# EAGLE design estacao_2_motordc_v6 (EAGLE 8.0.0)
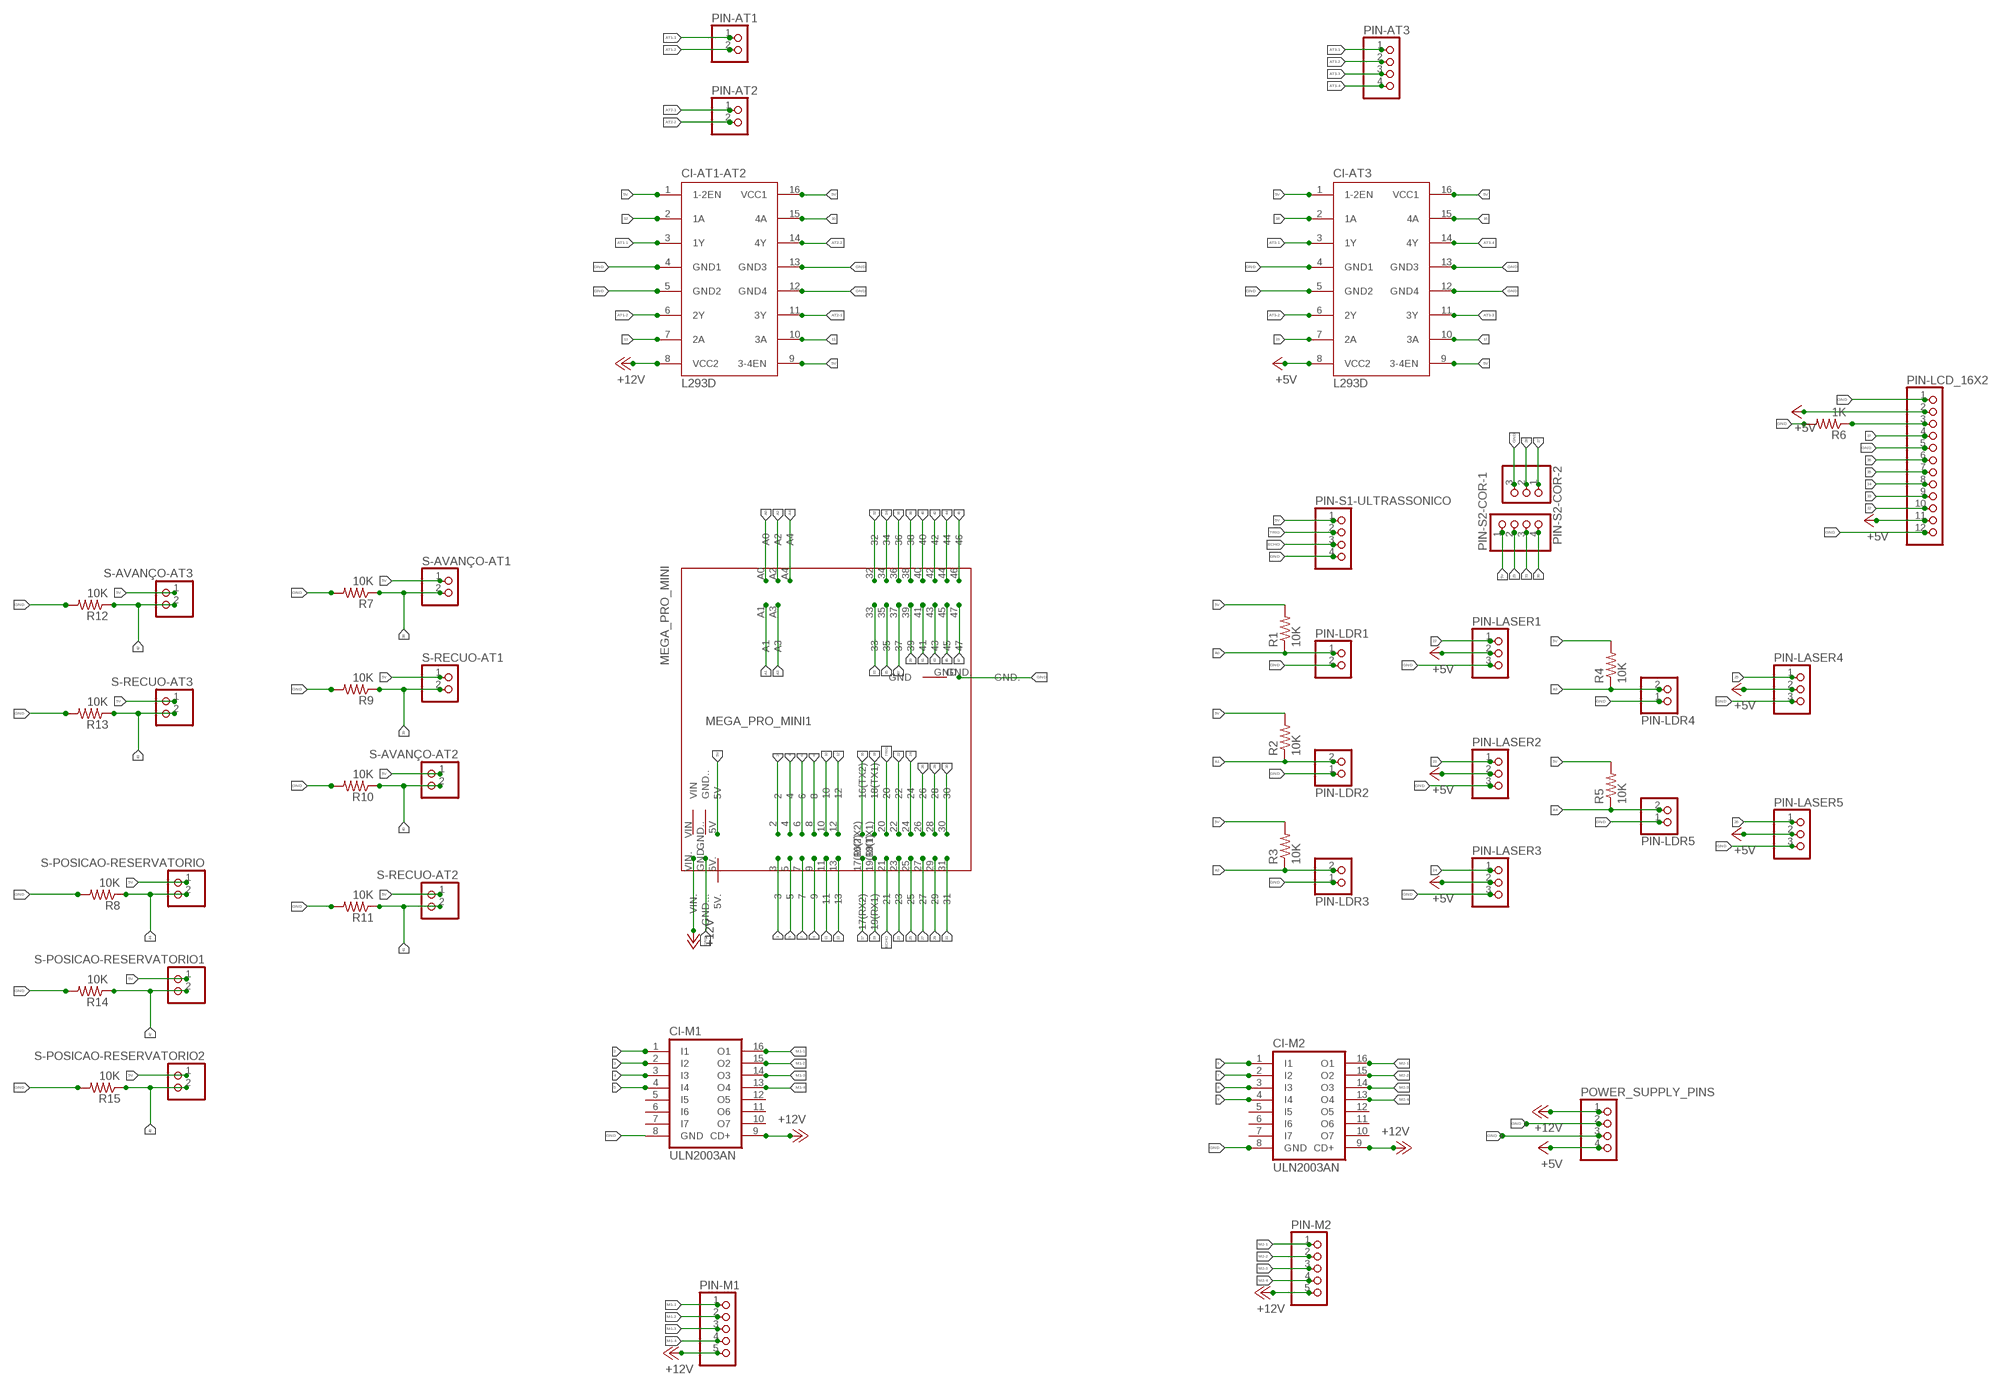
[diagram p0: schematic, sheet 1]

## Parts
CI-AT1-AT2  L293D  [DIL16]
CI-AT3  L293D  [DIL16]
CI-M1  ULN2003AN  [DIL16]
CI-M2  ULN2003AN  [DIL16]
MEGA_PRO_MINI1  MEGA_PRO_MINI  [MEGA_PRO_MINI]
PIN-AT1  PINHD-1X2  [1X02]
PIN-AT2  PINHD-1X2  [1X02]
PIN-AT3  PINHD-1X4  [1X04]
PIN-LASER1  PINHD-1X3  [1X03]
PIN-LASER2  PINHD-1X3  [1X03]
PIN-LASER3  PINHD-1X3  [1X03]
PIN-LASER4  PINHD-1X3  [1X03]
PIN-LASER5  PINHD-1X3  [1X03]
PIN-LCD_16X2  PINHD-1X12  [1X12]
PIN-LDR1  PINHD-1X2  [1X02]
PIN-LDR2  PINHD-1X2  [1X02]
PIN-LDR3  PINHD-1X2  [1X02]
PIN-LDR4  PINHD-1X2  [1X02]
PIN-LDR5  PINHD-1X2  [1X02]
PIN-M1  PINHD-1X5  [1X05]
PIN-M2  PINHD-1X5  [1X05]
PIN-S1-ULTRASSONICO  PINHD-1X4  [1X04]
PIN-S2-COR-1  PINHD-1X4  [1X04]
PIN-S2-COR-2  PINHD-1X3  [1X03]
POWER_SUPPLY_PINS  PINHD-1X4  [1X04]
R1  10K  R-US_0204/7  [0204/7]
R2  10K  R-US_0204/7  [0204/7]
R3  10K  R-US_0204/7  [0204/7]
R4  10K  R-US_0204/7  [0204/7]
R5  10K  R-US_0204/7  [0204/7]
R6  1K  R-US_0204/7  [0204/7]
R7  10K  R-US_0204/7  [0204/7]
R8  10K  R-US_0204/7  [0204/7]
R9  10K  R-US_0204/7  [0204/7]
R10  10K  R-US_0204/7  [0204/7]
R11  10K  R-US_0204/7  [0204/7]
R12  10K  R-US_0204/7  [0204/7]
R13  10K  R-US_0204/7  [0204/7]
R14  10K  R-US_0204/7  [0204/7]
R15  10K  R-US_0204/7  [0204/7]
S-AVANÇO-AT1  PINHD-1X2  [1X02]
S-AVANÇO-AT2  PINHD-1X2  [1X02]
S-AVANÇO-AT3  PINHD-1X2  [1X02]
S-POSICAO-RESERVATORIO  PINHD-1X2  [1X02]
S-POSICAO-RESERVATORIO1  PINHD-1X2  [1X02]
S-POSICAO-RESERVATORIO2  PINHD-1X2  [1X02]
S-RECUO-AT1  PINHD-1X2  [1X02]
S-RECUO-AT2  PINHD-1X2  [1X02]
S-RECUO-AT3  PINHD-1X2  [1X02]

## Nets
2: CI-M1.1(I1) MEGA_PRO_MINI1.2
3: CI-M1.2(I2) MEGA_PRO_MINI1.3
4: CI-M1.3(I3) MEGA_PRO_MINI1.4
5: CI-M1.4(I4) MEGA_PRO_MINI1.5
5V: CI-AT1-AT2.1(1-2EN) CI-AT1-AT2.9(3-4EN) CI-AT1-AT2.16(VCC1) CI-AT3.1(1-2EN) CI-AT3.9(3-4EN) CI-AT3.16(VCC1) MEGA_PRO_MINI1.5V PIN-S1-ULTRASSONICO.1 PIN-S2-COR-1.1 R1.2 R2.2 R3.2 R4.2 R5.2 S-AVANÇO-AT1.1 S-AVANÇO-AT2.1 S-AVANÇO-AT3.1 S-POSICAO-RESERVATORIO1.1 S-POSICAO-RESERVATORIO2.1 S-POSICAO-RESERVATORIO.1 S-RECUO-AT1.1 S-RECUO-AT2.1 S-RECUO-AT3.1
6: CI-M2.1(I1) MEGA_PRO_MINI1.6
7: CI-M2.2(I2) MEGA_PRO_MINI1.7
8: CI-M2.3(I3) MEGA_PRO_MINI1.8
9: CI-M2.4(I4) MEGA_PRO_MINI1.9
10: CI-AT1-AT2.15(4A) MEGA_PRO_MINI1.10
11: CI-AT1-AT2.10(3A) MEGA_PRO_MINI1.11
12: CI-AT1-AT2.2(1A) MEGA_PRO_MINI1.12
13: CI-AT1-AT2.7(2A) MEGA_PRO_MINI1.13
16: CI-AT3.15(4A) MEGA_PRO_MINI1.16(TX2)
17: CI-AT3.10(3A) MEGA_PRO_MINI1.17(RX2)
18: CI-AT3.2(1A) MEGA_PRO_MINI1.18(TX1)
19: CI-AT3.7(2A) MEGA_PRO_MINI1.19(RX1)
22: MEGA_PRO_MINI1.22 PIN-LASER1.1
23: MEGA_PRO_MINI1.23 PIN-LASER2.1
24: MEGA_PRO_MINI1.24 PIN-LASER3.1
25: MEGA_PRO_MINI1.25 PIN-LASER4.1
26: MEGA_PRO_MINI1.26 PIN-LASER5.1
27: MEGA_PRO_MINI1.27 PIN-S2-COR-2.1
28: MEGA_PRO_MINI1.28 PIN-S2-COR-2.2
29: MEGA_PRO_MINI1.29 PIN-S2-COR-1.2
30: MEGA_PRO_MINI1.30 PIN-S2-COR-1.4
31: MEGA_PRO_MINI1.31 PIN-S2-COR-1.3
32: MEGA_PRO_MINI1.32 PIN-LCD_16X2.10
33: MEGA_PRO_MINI1.33 PIN-LCD_16X2.9
34: MEGA_PRO_MINI1.34 PIN-LCD_16X2.8
35: MEGA_PRO_MINI1.35 PIN-LCD_16X2.7
36: MEGA_PRO_MINI1.36 PIN-LCD_16X2.6
37: MEGA_PRO_MINI1.37 PIN-LCD_16X2.4
38: MEGA_PRO_MINI1.38 R7.1 S-AVANÇO-AT1.2
39: MEGA_PRO_MINI1.39 R9.1 S-RECUO-AT1.2
40: MEGA_PRO_MINI1.40 R10.1 S-AVANÇO-AT2.2
41: MEGA_PRO_MINI1.41 R11.1 S-RECUO-AT2.2
42: MEGA_PRO_MINI1.42 R12.1 S-AVANÇO-AT3.2
43: MEGA_PRO_MINI1.43 R13.1 S-RECUO-AT3.2
44: MEGA_PRO_MINI1.44 R8.1 S-POSICAO-RESERVATORIO.2
45: MEGA_PRO_MINI1.45
46: MEGA_PRO_MINI1.46 R15.1 S-POSICAO-RESERVATORIO2.2
47: MEGA_PRO_MINI1.47 R14.1 S-POSICAO-RESERVATORIO1.2
+5V: CI-AT3.8(VCC2) PIN-LASER1.2 PIN-LASER2.2 PIN-LASER3.2 PIN-LASER4.2 PIN-LASER5.2 PIN-LCD_16X2.2 PIN-LCD_16X2.11 POWER_SUPPLY_PINS.4
+12V: CI-AT1-AT2.8(VCC2) CI-M1.9(CD+) CI-M2.9(CD+) MEGA_PRO_MINI1.VIN. PIN-M1.5 PIN-M2.5 POWER_SUPPLY_PINS.1
A0: MEGA_PRO_MINI1.A0 PIN-LDR1.1 R1.1
A1: MEGA_PRO_MINI1.A1 PIN-LDR2.2 R2.1
A2: MEGA_PRO_MINI1.A2 PIN-LDR3.2 R3.1
A3: MEGA_PRO_MINI1.A3 PIN-LDR4.2 R4.1
A4: MEGA_PRO_MINI1.A4 PIN-LDR5.2 R5.1
AT1-1: CI-AT1-AT2.3(1Y) PIN-AT1.1
AT1-2: CI-AT1-AT2.6(2Y) PIN-AT1.2
AT2-1: CI-AT1-AT2.11(3Y) PIN-AT2.1
AT2-2: CI-AT1-AT2.14(4Y) PIN-AT2.2
AT3-1: CI-AT3.3(1Y) PIN-AT3.1
AT3-2: CI-AT3.6(2Y) PIN-AT3.2
AT3-3: CI-AT3.11(3Y) PIN-AT3.3
AT3-4: CI-AT3.14(4Y) PIN-AT3.4
ECHO: MEGA_PRO_MINI1.21 PIN-S1-ULTRASSONICO.3
GND: CI-AT1-AT2.4(GND1) CI-AT1-AT2.5(GND2) CI-AT1-AT2.12(GND4) CI-AT1-AT2.13(GND3) CI-AT3.4(GND1) CI-AT3.5(GND2) CI-AT3.12(GND4) CI-AT3.13(GND3) CI-M1.8(GND) CI-M2.8(GND) MEGA_PRO_MINI1.GND. MEGA_PRO_MINI1.GND... PIN-LASER1.3 PIN-LASER2.3 PIN-LASER3.3 PIN-LASER4.3 PIN-LASER5.3 PIN-LCD_16X2.1 PIN-LCD_16X2.5 PIN-LCD_16X2.12 PIN-LDR1.2 PIN-LDR2.1 PIN-LDR3.1 PIN-LDR4.1 PIN-LDR5.1 PIN-S1-ULTRASSONICO.4 PIN-S2-COR-2.3 POWER_SUPPLY_PINS.2 POWER_SUPPLY_PINS.3 R6.2 R7.2 R8.2 R9.2 R10.2 R11.2 R12.2 R13.2 R14.2 R15.2
M1-1: CI-M1.16(O1) PIN-M1.1
M1-2: CI-M1.15(O2) PIN-M1.2
M1-3: CI-M1.14(O3) PIN-M1.3
M1-4: CI-M1.13(O4) PIN-M1.4
M2-1: CI-M2.16(O1) PIN-M2.1
M2-2: CI-M2.15(O2) PIN-M2.2
M2-3: CI-M2.14(O3) PIN-M2.3
M2-4: CI-M2.13(O4) PIN-M2.4
N$3: PIN-LCD_16X2.3 R6.1
TRIG: MEGA_PRO_MINI1.20 PIN-S1-ULTRASSONICO.2
Unconnected: CI-M1.5(I5) CI-M1.6(I6) CI-M1.7(I7) CI-M1.10(O7) CI-M1.11(O6) CI-M1.12(O5) CI-M2.5(I5) CI-M2.6(I6) CI-M2.7(I7) CI-M2.10(O7) CI-M2.11(O6) CI-M2.12(O5) MEGA_PRO_MINI1.5V. MEGA_PRO_MINI1.GND MEGA_PRO_MINI1.GND.. MEGA_PRO_MINI1.VIN

## Library data of the parts
CI-AT1-AT2 CI-AT3 = st-microelectronics:L293D: PUSH-PULL 4 CHANNEL DRIVER; MPN: L293D; OC_FARNELL: 9589619; OC_NEWARK: 56P8249
CI-M1 CI-M2 = uln-udn:ULN2003A: DRIVER ARRAY
MEGA_PRO_MINI1 = mega_pro_mini:MEGA_PRO_MINI
PIN-AT1 PIN-AT2 PIN-LDR1-PIN-LDR5 S-AVANÇO-AT1-S-AVANÇO-AT3 S-POSICAO-RESERVATORIO S-POSICAO-RESERVATORIO1 S-POSICAO-RESERVATORIO2 S-RECUO-AT1-S-RECUO-AT3 = pinhead:PINHD-1X2: PIN HEADER
PIN-AT3 PIN-S1-ULTRASSONICO PIN-S2-COR-1 POWER_SUPPLY_PINS = pinhead:PINHD-1X4: PIN HEADER
PIN-LASER1-PIN-LASER5 PIN-S2-COR-2 = pinhead:PINHD-1X3: PIN HEADER
PIN-LCD_16X2 = pinhead:PINHD-1X12: PIN HEADER
PIN-M1 PIN-M2 = pinhead:PINHD-1X5: PIN HEADER
R1-R15 = resistor:R-US_: RESISTOR, American symbol

## Board
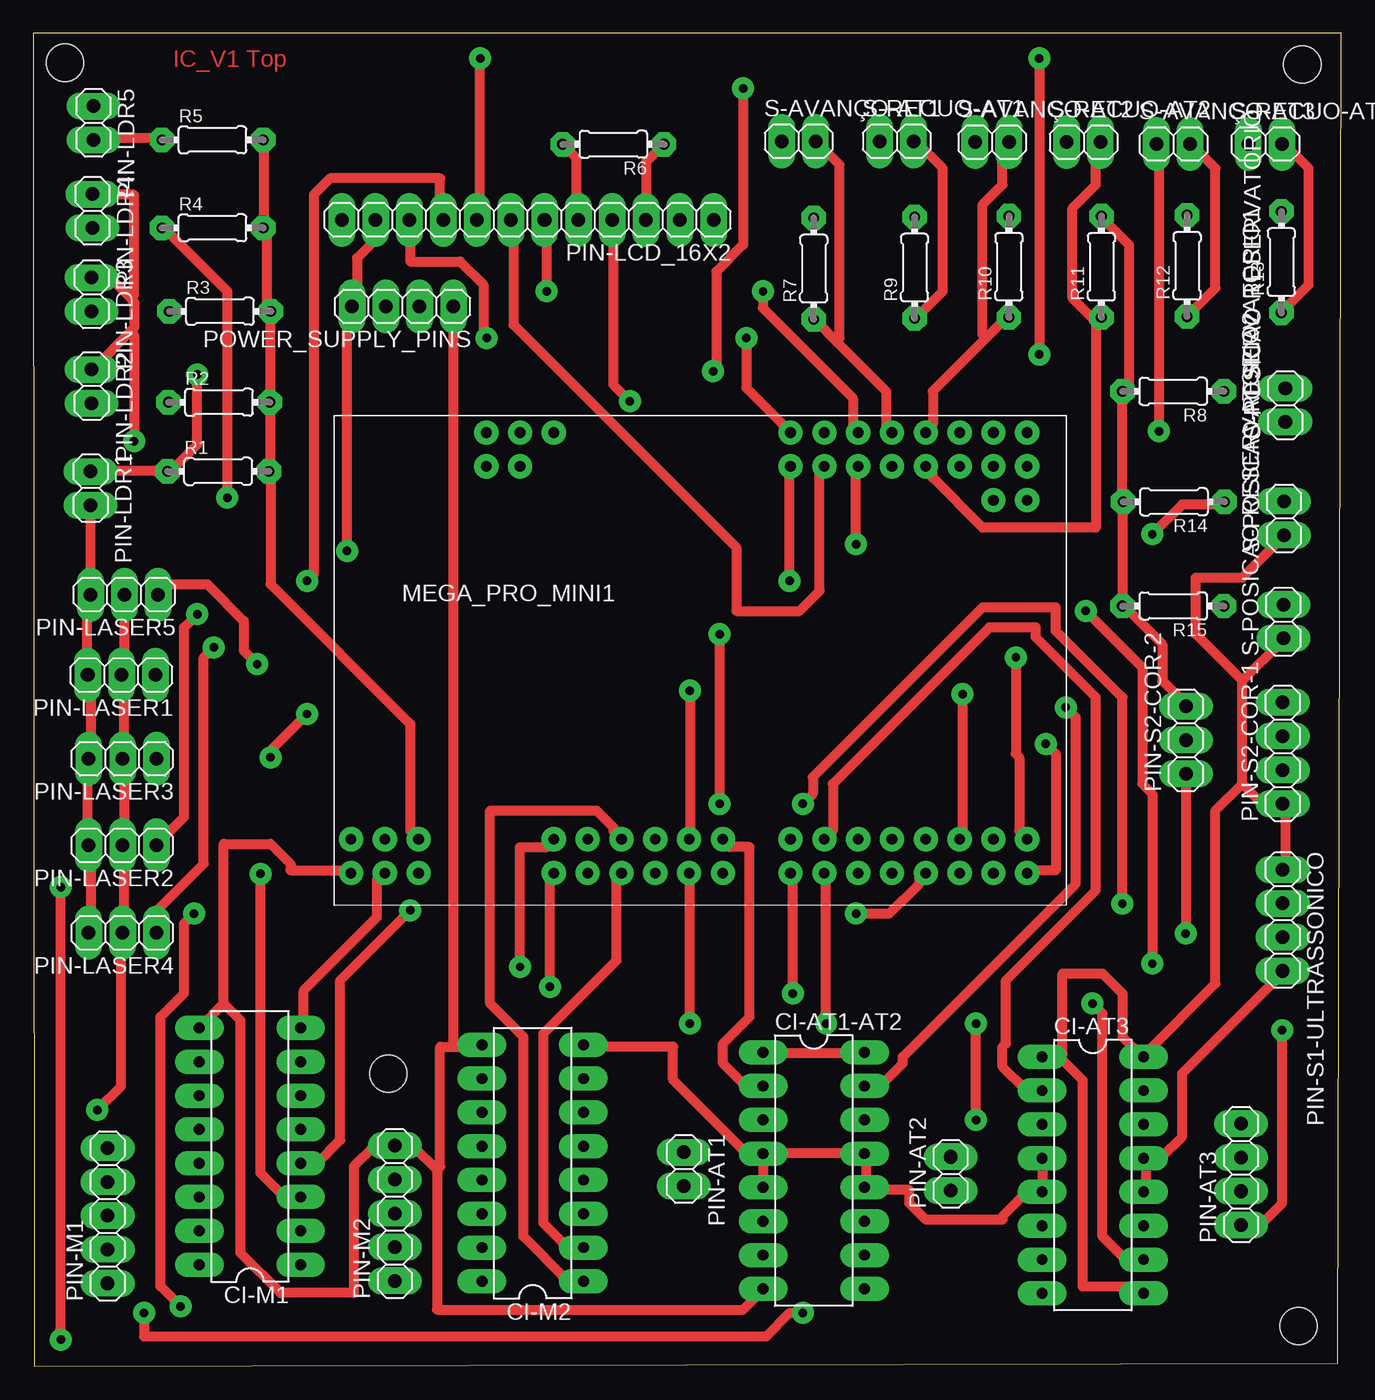
[diagram p1: board, top side]
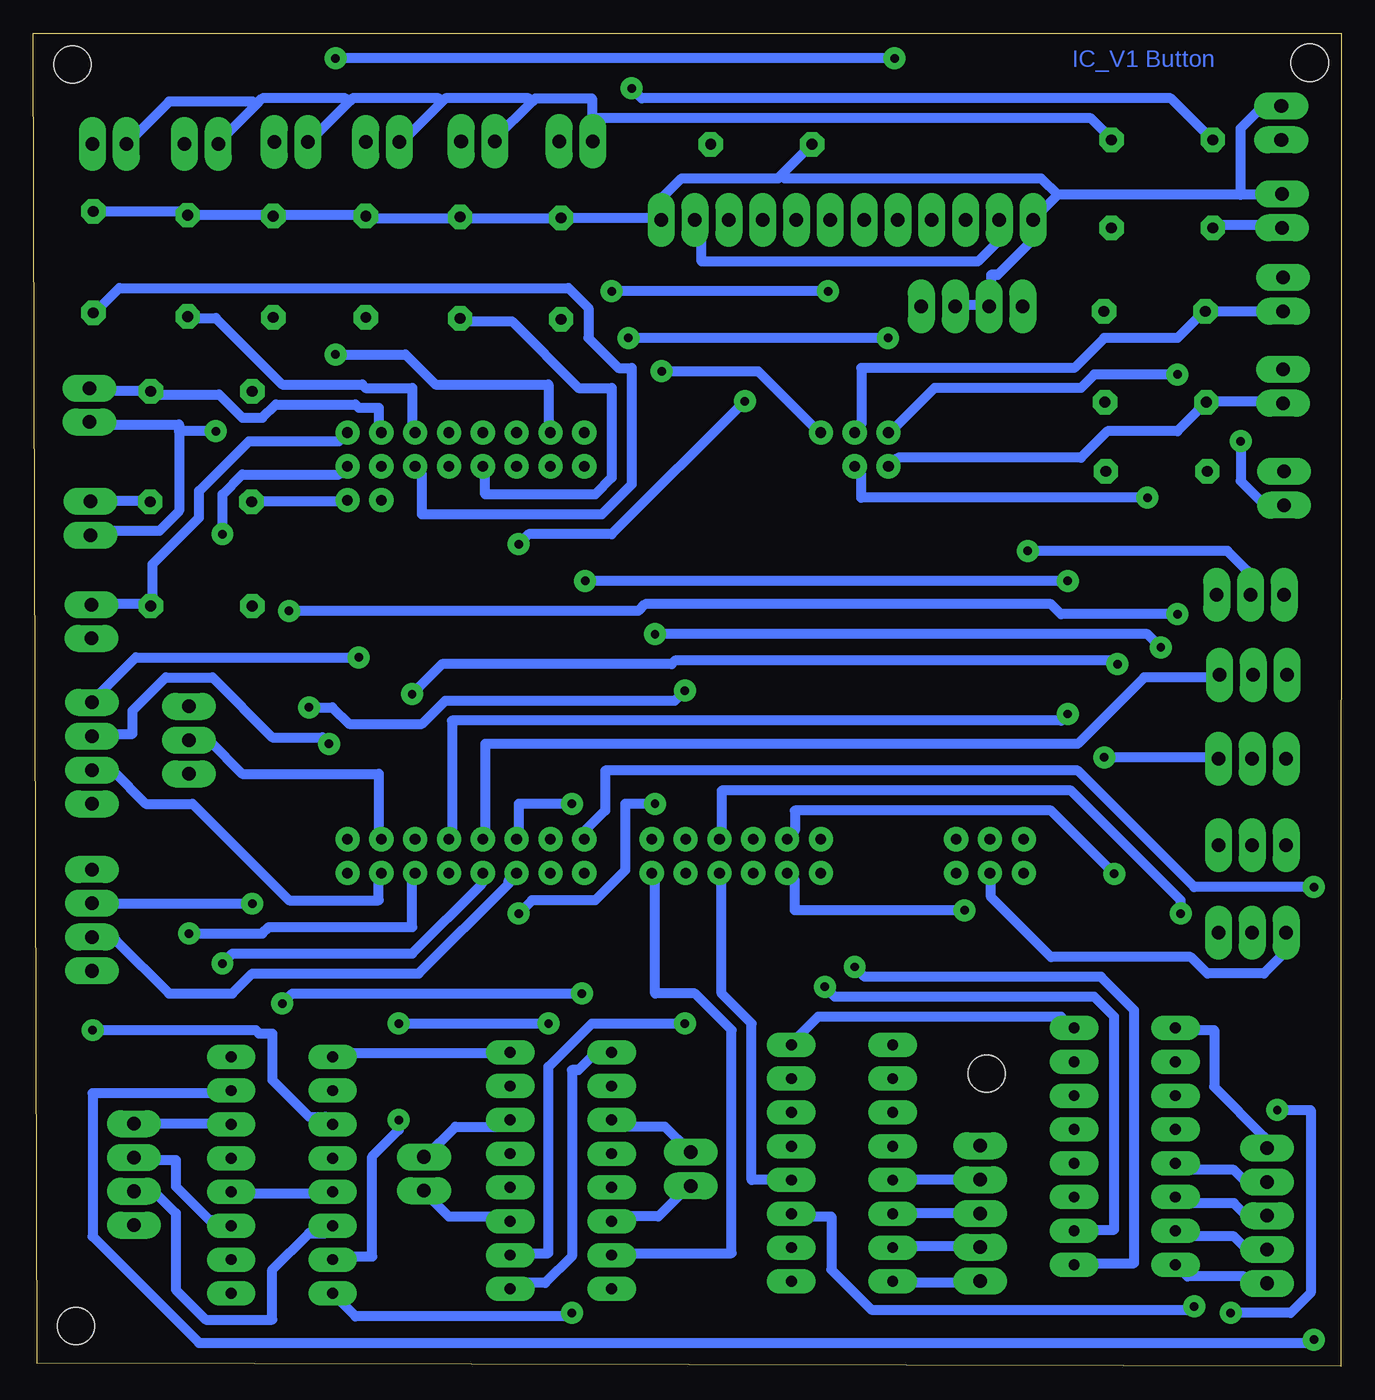
[diagram p2: board, bottom side, seen from below]

Size 98.28 x 100.14 mm. Coordinates in mm from the lower left corner, seen from the top.
Outline: 0.07,0 98,0.21 98.28,100.14 0,100.14 0.07,0
Copper layers (1*16): Top 0.035mm / dielectric 2mm / Bottom 0.035mm
Design rules "default *": minimum track width 30mil, minimum drill 25mil, track to track 25mil, track to pad 25mil, pad to pad 25mil, via to via 35mil, smd to smd 8mil, copper to edge 40mil, drill to drill 8mil, minimum pad ring 20mil, minimum via ring 20mil, stop-mask expansion 4mil, vias tented up to drill 0mil, thermal gap 10mil
Holes 2.8 mm at 26.67,21.98 95.06,3.01 2.38,97.93 95.34,97.79

### Footprints (pad centres in the part's own frame; a part is rotated, then mirrored left to right if it is on the bottom)
DIL16 = drill 0.813 long: 1 -8.89,-3.81; 2 -6.35,-3.81; 3 -3.81,-3.81; 4 -1.27,-3.81; 5 1.27,-3.81; 6 3.81,-3.81; 7 6.35,-3.81; 8 8.89,-3.81; 9 8.89,3.81; 10 6.35,3.81; 11 3.81,3.81; 12 1.27,3.81; 13 -1.27,3.81; 14 -3.81,3.81; 15 -6.35,3.81; 16 -8.89,3.81
MEGA_PRO_MINI = drill 0.8: 2 16.51,-31.82; 3 16.51,-34.36; 4 19.05,-31.82; 5 19.05,-34.36; 5V 6.35,-31.82; 5V. 6.35,-34.36; 6 21.59,-31.82; 7 21.59,-34.36; 8 24.13,-31.82; 9 24.13,-34.36; 10 26.67,-31.82; 11 26.67,-34.36; 12 29.21,-31.82; 13 29.21,-34.36; 16(TX2) 34.29,-31.82; 17(RX2) 34.29,-34.36; 18(TX1) 36.83,-31.82; 19(RX1) 36.83,-34.36; 20 39.37,-31.82; 21 39.37,-34.36; 22 41.91,-31.82; 23 41.91,-34.36; 24 44.45,-31.82; 25 44.45,-34.36; 26 46.99,-31.82; 27 46.99,-34.36; 28 49.53,-31.82; 29 49.53,-34.36; 30 52.07,-31.82; 31 52.07,-34.36; 32 34.29,-1.27; 33 34.29,-3.81; 34 36.83,-1.27; 35 36.83,-3.81; 36 39.37,-1.27; 37 39.37,-3.81; 38 41.91,-1.27; 39 41.91,-3.81; 40 44.45,-1.27; 41 44.45,-3.81; 42 46.99,-1.27; 43 46.99,-3.81; 44 49.53,-1.27; 45 49.53,-3.81; 46 52.07,-1.27; 47 52.07,-3.81; A0 11.43,-1.27; A1 11.43,-3.81; A2 13.97,-1.27; A3 13.97,-3.81; A4 16.51,-1.27; GND 49.53,-6.35; GND. 52.07,-6.35; GND.. 3.81,-31.82; GND... 3.81,-34.36; VIN 1.27,-31.82; VIN. 1.27,-34.36
1X02 = drill 1.016 long: 1 -1.27,0; 2 1.27,0
1X04 = drill 1.016 long: 1 -3.81,0; 2 -1.27,0; 3 1.27,0; 4 3.81,0
1X03 = drill 1.016 long: 1 -2.54,0; 2 0,0; 3 2.54,0
1X12 = drill 1.016 long: 1 -13.97,0; 2 -11.43,0; 3 -8.89,0; 4 -6.35,0; 5 -3.81,0; 6 -1.27,0; 7 1.27,0; 8 3.81,0; 9 6.35,0; 10 8.89,0; 11 11.43,0; 12 13.97,0
1X05 = drill 1.016 long: 1 -5.08,0; 2 -2.54,0; 3 0,0; 4 2.54,0; 5 5.08,0
0204/7 = drill 0.813 octagon: 1 -3.81,0; 2 3.81,0

### Placement (x,y rotation side)
CI-AT1-AT2  58.64,14.7 270 top
CI-AT3  79.6,14.36 270 top
CI-M1  16.28,16.52 90 top
CI-M2  37.52,15.26 90 top
MEGA_PRO_MINI1  22.6,71.41 0 top
PIN-AT1  48.88,14.81 270 top
PIN-AT2  68.92,14.46 90 top
PIN-AT3  90.73,14.41 90 top
PIN-LASER1  6.63,51.93 180 top
PIN-LASER2  6.7,39.13 180 top
PIN-LASER3  6.7,45.64 180 top
PIN-LASER4  6.7,32.56 180 top
PIN-LASER5  6.84,57.97 180 top
PIN-LCD_16X2  37.14,86.13 180 top
PIN-LDR1  4.31,65.96 270 top
PIN-LDR2  4.38,73.62 270 top
PIN-LDR3  4.38,80.52 270 top
PIN-LDR4  4.45,86.79 270 top
PIN-LDR5  4.52,93.4 270 top
PIN-M1  5.59,11.31 90 top
PIN-M2  27.16,11.48 90 top
PIN-S1-ULTRASSONICO  93.87,33.51 270 top
PIN-S2-COR-1  93.87,46.06 90 top
PIN-S2-COR-2  86.59,47.04 90 top
POWER_SUPPLY_PINS  27.75,79.62 180 top
R1  13.89,67.23 0 top
R2  13.96,72.42 0 top
R3  14.03,79.25 0 top
R4  13.47,85.52 0 top
R5  13.47,92.13 0 top
R6  43.58,91.8 180 top
R7  58.63,82.46 90 top
R8  85.64,73.24 180 top
R9  66.21,82.53 90 top
R10  73.3,82.6 90 top
R11  80.25,82.6 90 top
R12  86.68,82.67 90 top
R13  93.77,82.95 90 top
R14  85.69,64.94 180 top
R15  85.64,57.11 180 top
S-AVANÇO-AT1  57.5,92.03 0 top
S-AVANÇO-AT2  72.03,91.96 0 top
S-AVANÇO-AT3  85.65,91.82 0 top
S-POSICAO-RESERVATORIO  94.06,72.21 90 top
S-POSICAO-RESERVATORIO1  93.97,63.71 90 top
S-POSICAO-RESERVATORIO2  93.92,55.95 90 top
S-RECUO-AT1  64.87,92.03 0 top
S-RECUO-AT2  78.91,91.96 0 top
S-RECUO-AT3  92.56,91.82 0 top

### Tracks (layer width: path | path; a pad name or v marks a point on that pad's centre or on a via)
2  (via drill 0.64)
  Top 0.762: v36.57,30 36.57,39 38.57,39 39.07,39.5 MEGA_PRO_MINI1.2
  Bottom 0.762: v36.57,30 35.82,29.25 18.07,29.25 15.57,26.75 15.57,7.75 20.07,7.75 CI-M1.1
3  (via drill 0.64)
  Top 0.762: v38.82,28.5 38.82,36.75 39.07,37 MEGA_PRO_MINI1.3
  Bottom 0.762: v38.82,28.5 38.07,27.75 18.57,27.75 17.07,26.25 17.07,10.25 20.07,10.25 CI-M1.2
4  (via drill 0.64)
  Top 0.762: v17.07,37 17.07,14.5 18.82,12.75 20.07,12.75 CI-M1.3
  Bottom 0.762: v17.07,37 21.82,41.75 41.07,41.75 41.07,40.25 41.57,39.75 MEGA_PRO_MINI1.4
5  (via drill 0.64)
  Top 0.762: v28.32,34.25 23.07,29 23.07,17 21.32,15.25 CI-M1.4
  Bottom 0.762: v28.32,34.25 41.07,34.25 41.07,36.5 41.57,37 MEGA_PRO_MINI1.5
5V  (via drill 0.64)
  Top 0.762: PIN-S1-ULTRASSONICO.1 94.07,37.5 94.07,42.25 PIN-S2-COR-1.1 92.32,42.25 90.82,43.75 | 90.82,51.5 93.82,54.5 S-POSICAO-RESERVATORIO2.1 | 90.82,43.75 90.82,51.5 | 90.82,51.5 87.32,55 87.32,59.25 90.82,59.25 93.82,62.25 S-POSICAO-RESERVATORIO1.1 | CI-AT1-AT2.1 55.07,23.5 62.32,23.5 CI-AT1-AT2.16 | CI-AT3.9 83.32,5.5 82.82,6 78.82,6 78.82,21.5 77.07,23.25 CI-AT3.1 77.32,23.5 77.32,29.5 80.32,29.5 81.82,28 81.82,24.75 83.32,23.25 CI-AT3.16 83.57,23.5 88.82,28.75 88.82,41.75 90.82,43.75 | R5.2 17.32,92 17.32,85.75 R4.2 17.57,85.5 17.57,79.5 R3.2 17.82,79.25 17.82,72.75 R2.2 17.82,72.25 17.82,67.5 R1.2 17.82,67 17.82,58.75 28.32,48.25 28.32,40.25 28.82,39.75 MEGA_PRO_MINI1.5V | v84.57,70.25 84.57,91.75 S-AVANÇO-AT3.1
  Bottom 0.762: 87.32,70.25 87.32,70.75 93.82,70.75 S-POSICAO-RESERVATORIO.1 | 87.32,70.25 87.32,64.25 88.82,62.75 93.57,62.75 93.82,62.5 S-POSICAO-RESERVATORIO1.1 | CI-AT1-AT2.9 62.32,6 62.07,6.25 59.82,6.25 57.82,8.25 57.82,22.25 57.32,22.25 56.07,23.5 55.07,23.5 CI-AT1-AT2.1 | CI-AT3.1 75.57,23.25 75.32,23.5 62.57,23.5 CI-AT1-AT2.16 | 60.82,95 63.57,92.25 S-RECUO-AT1.1 | 60.82,95 60.57,95.25 56.32,95.25 56.32,92.25 S-AVANÇO-AT1.1 56.07,93.75 18.82,93.75 17.32,92.25 R5.2 | 67.57,95 67.32,95.25 61.07,95.25 60.82,95 | 67.57,95 70.57,92 S-AVANÇO-AT2.1 | 74.57,95 74.32,95.25 67.82,95.25 67.57,95 | 74.57,95 77.57,92 S-RECUO-AT2.1 | 81.57,94.75 81.07,95.25 74.82,95.25 74.57,95 | 81.57,94.75 84.32,92 S-AVANÇO-AT3.1 | S-RECUO-AT3.1 91.07,92 88.07,95 81.82,95 81.57,94.75 | v84.57,70.25 87.32,70.25
6
  Top 0.762: MEGA_PRO_MINI1.6 44.07,39.75 43.57,40.25 43.57,40.5 42.32,41.75 34.32,41.75 34.32,27.25 36.82,24.75 36.82,9.75 40.07,6.5 41.32,6.5 CI-M2.1
7
  Top 0.762: MEGA_PRO_MINI1.7 44.07,37 43.82,36.75 43.82,30.5 38.32,25 38.32,10.75 40.07,9 41.32,9 CI-M2.2
8  (via drill 0.64)
  Top 0.762: v12.07,34 11.32,33.25 11.32,28 9.57,26.25 9.57,6 v11.07,4.5
  Bottom 0.762: v12.07,34 12.07,35 20.32,43.25 46.57,43.25 46.57,39.75 MEGA_PRO_MINI1.8 | v11.07,4.5 11.32,4.25 35.32,4.25 38.32,7.25 38.32,11.25 41.32,11.25 CI-M2.3
9
  Bottom 0.762: MEGA_PRO_MINI1.9 46.57,37 46.57,28 44.32,25.75 44.32,14 41.57,14 CI-M2.4
10  (via drill 0.64)
  Top 0.762: v49.32,50.75 49.32,39.75 MEGA_PRO_MINI1.10 | v77.57,49.5 78.32,48.75 78.32,36.25 65.32,23.25 65.32,22.75 63.82,21.25 62.57,21.25 CI-AT1-AT2.15
  Bottom 0.762: v49.32,50.75 50.07,50 67.32,50 69.07,48.25 74.57,48.25 75.82,49.5 v77.57,49.5
11  (via drill 0.64)
  Top 0.762: v49.32,25.75 49.32,37 MEGA_PRO_MINI1.11
  Bottom 0.762: v49.32,25.75 56.32,25.75 59.57,22.5 59.57,8.5 62.32,8.5 CI-AT1-AT2.10
12
  Top 0.762: MEGA_PRO_MINI1.12 51.82,39.5 52.32,39 53.82,39 53.82,26.25 51.82,24.25 51.82,22.75 53.32,21.25 54.82,21.25 CI-AT1-AT2.2
13
  Bottom 0.762: MEGA_PRO_MINI1.13 51.57,37 51.57,28 48.57,28 45.82,25.25 45.82,8.5 54.82,8.5 CI-AT1-AT2.7
16  (via drill 0.64)
  Top 0.762: v2.07,2 v2.07,36
  Bottom 0.762: v2.07,36 11.07,36 19.82,44.75 55.32,44.75 55.32,41.75 56.82,40.25 56.82,39.75 MEGA_PRO_MINI1.16(TX2) | v2.07,2 2.32,1.75 85.82,1.75 93.82,9.75 93.82,20.5 83.57,20.5 CI-AT3.15
17  (via drill 0.64)
  Top 0.762: v57.07,28 57.07,37 MEGA_PRO_MINI1.17(RX2) | v79.57,27.25 80.32,26.5 80.32,9.75 81.82,8.25 83.32,8.25 CI-AT3.10
  Bottom 0.762: v57.07,28 78.82,28 v79.57,27.25
18
  Top 0.762: MEGA_PRO_MINI1.18(TX1) 59.57,39.75 60.07,40.25 60.07,43.75 71.82,55.5 75.32,55.5 75.32,54.75 79.82,50.25 79.82,35.75 73.07,29 73.07,24.25 72.82,24 72.82,22.5 74.57,20.75 75.57,20.75 CI-AT3.2
19  (via drill 0.64)
  Top 0.762: v59.57,25.75 59.57,37 MEGA_PRO_MINI1.19(RX1) | v70.82,18.5 v70.82,25.75
  Bottom 0.762: v70.82,25.75 v59.57,25.75 | v70.82,18.5 70.82,17.75 72.82,15.75 72.82,8.25 75.57,8.25 CI-AT3.7
22
  Bottom 0.762: MEGA_PRO_MINI1.22 64.32,39.75 64.32,46.75 19.82,46.75 14.82,51.75 9.32,51.75 PIN-LASER1.1
23  (via drill 0.64)
  Top 0.762: v84.07,30.25 84.07,43 83.32,43.75 83.32,52.5 v79.07,56.75 | v12.32,56.5 11.32,55.5 11.32,41.25 9.32,39.25 PIN-LASER2.1
  Bottom 0.762: v84.07,30.25 83.32,31 69.82,31 64.57,36.25 64.57,37 MEGA_PRO_MINI1.23 | v79.07,56.75 52.82,56.75 52.32,57.25 21.82,57.25 21.07,56.5 v12.32,56.5
24  (via drill 0.64)
  Top 0.762: v20.57,49 17.82,46.25 v17.82,45.75
  Bottom 0.762: v20.57,49 21.07,48.5 66.82,48.5 66.82,39.75 MEGA_PRO_MINI1.24 | v17.82,45.75 9.32,45.75 PIN-LASER3.1
25  (via drill 0.64)
  Top 0.762: v61.82,34 64.32,34 66.57,36.25 66.57,36.75 66.82,37 MEGA_PRO_MINI1.25 | v51.57,55 v51.57,42.25 | v13.57,54 12.82,53.25 12.82,37.75 9.32,34.25 9.32,32.75 PIN-LASER4.1
  Bottom 0.762: v61.82,34 60.82,35 56.07,35 53.82,37.25 53.82,42.25 v51.57,42.25 | v51.57,55 14.57,55 v13.57,54
26  (via drill 0.64)
  Top 0.762: v69.82,50.5 69.82,39.75 MEGA_PRO_MINI1.26 | v16.82,52.75 15.82,53.75 15.82,56 13.07,58.75 9.57,58.75 9.57,58 PIN-LASER5.1
  Bottom 0.762: v69.82,50.5 67.57,52.75 50.32,52.75 50.07,53 17.07,53 v16.82,52.75
27  (via drill 0.64)
  Top 0.762: v86.57,32.5 86.57,44.5 PIN-S2-COR-2.1
  Bottom 0.762: v86.57,32.5 81.07,32.5 80.57,33 69.82,33 69.82,37 MEGA_PRO_MINI1.27
28
  Bottom 0.762: MEGA_PRO_MINI1.28 72.32,39.75 72.32,44.5 82.57,44.5 85.07,47 86.57,47 PIN-S2-COR-2.2
29
  Bottom 0.762: MEGA_PRO_MINI1.29 72.32,37 72.32,35 79.07,35 86.32,42.25 89.82,42.25 92.32,44.75 93.82,44.75 PIN-S2-COR-1.2
30  (via drill 0.64)
  Top 0.762: v73.82,53.25 73.82,46 74.07,45.75 74.07,40.25 74.57,39.75 MEGA_PRO_MINI1.30
  Bottom 0.762: v73.82,53.25 90.57,53.25 93.82,50 PIN-S2-COR-1.4
31  (via drill 0.64)
  Top 0.762: v76.07,46.75 76.82,46 76.82,37.25 74.82,37.25 MEGA_PRO_MINI1.31
  Bottom 0.762: v76.07,46.75 76.57,47.25 80.32,47.25 84.82,51.75 88.32,51.75 90.82,49.25 90.82,47.5 93.82,47.5 PIN-S2-COR-1.3
32  (via drill 0.64)
  Top 0.762: v53.57,77.25 53.57,73.5 56.82,70.25 MEGA_PRO_MINI1.32 | v34.07,77.25 33.82,77.5 33.82,81.25 32.07,83 28.32,83 28.32,86 PIN-LCD_16X2.10
  Bottom 0.762: v34.07,77.25 v53.57,77.25
33  (via drill 0.64)
  Top 0.762: v56.82,59 56.82,67.5 MEGA_PRO_MINI1.33 | v20.57,59 21.07,59.5 21.07,88 22.32,89.25 30.57,89.25 30.57,86.25 PIN-LCD_16X2.9
  Bottom 0.762: v20.57,59 v56.82,59
34  (via drill 0.64)
  Top 0.762: v75.57,98.25 v75.57,76 | v33.57,98.25 33.57,86.25 PIN-LCD_16X2.8
  Bottom 0.762: v75.57,76 70.32,76 68.07,73.75 59.57,73.75 59.57,70.25 MEGA_PRO_MINI1.34 | v33.57,98.25 v75.57,98.25
35
  Top 0.762: MEGA_PRO_MINI1.35 59.32,67.5 59.07,67.25 59.07,58.25 57.57,56.75 52.82,56.75 52.82,61.5 36.07,78.25 36.07,86 PIN-LCD_16X2.7
36  (via drill 0.64)
  Top 0.762: v54.82,80.75 54.82,79.5 61.57,72.75 61.57,70.5 61.82,70.25 MEGA_PRO_MINI1.36 | v38.57,80.75 38.57,86 PIN-LCD_16X2.6
  Bottom 0.762: v38.57,80.75 v54.82,80.75
37  (via drill 0.64)
  Top 0.762: v61.82,61.75 61.82,67.5 MEGA_PRO_MINI1.37 | v44.82,72.5 43.57,73.75 43.57,86 PIN-LCD_16X2.4
  Bottom 0.762: v61.82,61.75 61.07,62.5 54.82,62.5 v44.82,72.5
38
  Top 0.762: 60.32,77 58.82,78.5 R7.1 | 60.32,77 64.07,73.25 64.07,70.5 64.32,70.25 MEGA_PRO_MINI1.38 | S-AVANÇO-AT1.2 58.82,92 60.57,90.25 60.57,77.25 60.32,77
39
  Top 0.762: S-RECUO-AT1.2 66.32,92 68.32,90 68.32,80.75 66.32,78.75 R9.1
  Bottom 0.762: MEGA_PRO_MINI1.39 64.32,67.5 64.32,65.5 56.07,65.5 54.82,66.75 54.82,73.5 57.32,73.5 62.32,78.5 66.07,78.5 R9.1
40
  Top 0.762: 71.57,77.25 73.07,78.75 R10.1 | 71.57,77.25 67.57,73.25 67.57,70.75 67.07,70.25 MEGA_PRO_MINI1.40 | S-AVANÇO-AT2.2 73.07,91.75 72.82,91.5 72.82,88.75 71.32,87.25 71.32,77.5 71.57,77.25
41
  Top 0.762: MEGA_PRO_MINI1.41 67.07,67.5 67.57,67 67.57,66.75 71.32,63 79.82,63 79.82,78.5 80.07,78.75 R11.1 79.57,78.75 78.07,80.25 78.07,87 79.82,88.75 79.82,91.5 80.07,91.75 S-RECUO-AT2.2
42
  Top 0.762: R12.1 88.82,81 88.82,90 87.07,91.75 S-AVANÇO-AT3.2
  Bottom 0.762: MEGA_PRO_MINI1.42 69.82,70.25 69.82,73.5 73.32,73.5 73.57,73.75 79.57,73.75 84.57,78.75 86.57,78.75 R12.1
43
  Top 0.762: S-RECUO-AT3.2 94.07,91.75 95.82,90 95.82,81.25 93.82,79.25 R13.1
  Bottom 0.762: MEGA_PRO_MINI1.43 69.57,67.5 69.07,67 69.07,64 55.57,64 53.32,66.25 53.32,75 54.32,75 56.57,77.25 56.57,79.5 58.07,81 91.82,81 93.57,79.25 R13.1
44
  Bottom 0.762: MEGA_PRO_MINI1.44 72.32,70.25 72.32,72 73.82,72 74.07,72.25 80.07,72.25 81.07,71.25 82.57,71.25 84.32,73 89.32,73 R8.1 89.82,73.25 93.82,73.25 S-POSICAO-RESERVATORIO.2
46
  Bottom 0.762: MEGA_PRO_MINI1.46 74.82,70 75.32,69.5 82.07,69.5 85.82,65.75 85.82,63.75 89.32,60.25 89.32,57.25 R15.1 89.82,57.25 93.82,57.25 S-POSICAO-RESERVATORIO2.2
47  (via drill 0.64)
  Top 0.762: v84.07,62.5 86.32,64.75 89.32,64.75 R14.1
  Bottom 0.762: v84.07,62.5 84.07,65.5 82.57,67 75.32,67 74.82,67.5 MEGA_PRO_MINI1.47 | S-POSICAO-RESERVATORIO1.2 93.82,65 89.57,65 R14.1
+5V  (via drill 0.64)
  Top 0.762: PIN-LCD_16X2.11 25.57,86 25.57,84.5 24.32,83.25 24.32,80 POWER_SUPPLY_PINS.4 23.57,79.5 v23.57,61.25 | PIN-LASER5.2 6.82,57.75 6.82,52 PIN-LASER1.2 6.82,51.75 6.82,46 PIN-LASER3.2 6.82,45.5 6.82,39.25 PIN-LASER2.2 6.82,38.75 6.82,32.75 PIN-LASER4.2 6.57,32.5 6.57,21 v4.82,19.25 | v57.82,4 56.82,4 55.07,2.25 8.32,2.25 v8.32,4
  Bottom 0.762: PIN-LCD_16X2.2 48.57,86 48.07,85.5 48.07,83 27.32,83 25.82,84.5 25.82,86 PIN-LCD_16X2.11 | CI-AT3.8 74.07,3.75 58.07,3.75 v57.82,4 | v8.32,4 3.82,4 2.32,5.5 2.32,19.25 v4.82,19.25 | v23.57,61.25 8.57,61.25 7.07,59.75 7.07,58 PIN-LASER5.2
+12V
  Top 0.762: 14.32,27.25 14.32,39.25 17.82,39.25 19.32,37.75 19.32,37.25 23.82,37.25 MEGA_PRO_MINI1.VIN. | 14.32,27.25 12.57,25.5 CI-M1.9 | 30.32,14.75 30.32,4.25 53.32,4.25 54.82,5.75 CI-AT1-AT2.8 | 30.32,14.75 28.57,16.5 27.32,16.5 PIN-M2.5 26.82,16.5 25.57,16.5 24.07,15 24.07,5.5 18.57,5.5 15.57,8.5 15.57,26 14.32,27.25 | 31.57,24 30.57,24 30.57,15 30.32,14.75 | 31.57,24 33.57,24 CI-M2.9 | 31.57,24 31.57,79.5 POWER_SUPPLY_PINS.1
  Bottom 0.762: PIN-M1.5 5.82,16.5 5.82,17.25 9.57,21 9.57,25.25 12.32,25.25 CI-M1.9
A0  (via drill 0.64)
  Top 0.762: v12.32,74.5 12.32,69.25 10.32,67.25 R1.1 9.82,67.25 4.32,67.25 PIN-LDR1.1
  Bottom 0.762: v12.32,74.5 18.57,74.5 19.57,73.5 30.57,73.5 33.82,70.25 MEGA_PRO_MINI1.A0
A1
  Bottom 0.762: MEGA_PRO_MINI1.A1 33.82,67.75 33.32,68.25 19.57,68.25 17.57,70.25 12.32,70.25 R2.1 9.82,72.5 4.57,72.5 PIN-LDR2.2
A2
  Bottom 0.762: MEGA_PRO_MINI1.A2 36.57,70.25 36.07,70.75 36.07,75 20.07,75 17.82,77.25 12.32,77.25 10.32,79.25 R3.1 PIN-LDR3.2
A3  (via drill 0.64)
  Top 0.762: v14.57,65.25 14.57,80.75 9.82,85.5 R4.1
  Bottom 0.762: v14.57,65.25 36.07,65.25 36.07,67 36.57,67.5 MEGA_PRO_MINI1.A3 | PIN-LDR4.2 4.57,85.75 9.57,85.75 R4.1
A4  (via drill 0.64)
  Top 0.762: v51.07,74.75 51.32,75 51.32,82.25 53.32,84.25 v53.32,96 | PIN-LDR5.2 4.57,92.25 9.57,92.25 R5.1
  Bottom 0.762: v51.07,74.75 43.82,74.75 39.32,70.25 MEGA_PRO_MINI1.A4 | v53.32,96 52.57,95.25 12.82,95.25 9.82,92.25 R5.1
AT1-1
  Bottom 0.762: CI-AT1-AT2.3 54.32,18 50.82,18 49.07,16.25 PIN-AT1.1
AT1-2
  Bottom 0.762: CI-AT1-AT2.6 54.82,11 54.57,11.25 51.32,11.25 49.07,13.5 PIN-AT1.2
AT2-1
  Bottom 0.762: CI-AT1-AT2.11 62.57,11 62.82,11.25 67.07,11.25 68.82,13 PIN-AT2.1
AT2-2
  Bottom 0.762: CI-AT1-AT2.14 62.57,18.5 63.07,18 66.57,18 68.82,15.75 PIN-AT2.2
AT3-1  (via drill 0.64)
  Top 0.762: v93.82,25.25 93.82,12.25 92.32,10.75 90.82,10.75 PIN-AT3.1
  Bottom 0.762: v93.82,25.25 81.57,25.25 81.32,25 80.32,25 80.32,21.5 77.57,18.75 76.32,18.75 75.82,18.25 CI-AT3.3
AT3-2
  Bottom 0.762: CI-AT3.6 75.82,10.5 76.32,10 77.57,10 80.32,7.25 80.32,3.5 85.32,3.5 87.57,5.75 87.57,11.5 89.07,13 90.57,13 PIN-AT3.2
AT3-3
  Bottom 0.762: CI-AT3.11 83.57,10.75 83.82,11 85.07,11 87.57,13.5 87.57,15.5 90.57,15.5 PIN-AT3.3
AT3-4
  Bottom 0.762: CI-AT3.14 83.57,18.25 90.57,18.25 PIN-AT3.4
ECHO
  Bottom 0.762: MEGA_PRO_MINI1.21 62.07,37 62.57,36.5 62.57,36.25 69.32,29.5 81.82,29.5 83.32,28 88.07,28 92.07,32 93.82,32 PIN-S1-ULTRASSONICO.3
GND  (via drill 0.64)
  Top 0.762: MEGA_PRO_MINI1.GND... 26.32,37 25.82,36.5 25.82,33.75 20.32,28.25 20.32,25.5 CI-M1.8 | CI-AT1-AT2.5 54.82,13.5 54.82,15.75 CI-AT1-AT2.4 | CI-AT1-AT2.4 55.07,16 62.07,16 CI-AT1-AT2.13 62.57,15.75 62.57,13.5 CI-AT1-AT2.12 62.82,13.25 65.82,13.25 65.82,12.25 67.07,11 72.82,11 72.82,11.25 74.32,12.75 75.57,12.75 CI-AT3.5 75.82,13.25 75.82,15.5 CI-AT3.4 | CI-AT3.12 83.57,13.25 83.57,15.5 CI-AT3.13 83.82,15.75 84.82,15.75 86.32,17.25 86.32,22 93.82,29.5 PIN-S1-ULTRASSONICO.4 | CI-M2.8 41.57,24 48.07,24 48.07,21.5 53.32,16.25 54.57,16.25 CI-AT1-AT2.4 | PIN-LASER4.3 4.32,32.75 4.32,39 PIN-LASER2.3 4.07,39.5 4.07,45.5 PIN-LASER3.3 4.32,45.75 4.32,51.75 PIN-LASER1.3 4.07,52.25 4.07,57.75 PIN-LASER5.3 4.32,58.25 4.32,64.5 PIN-LDR1.2 | 7.32,77.75 7.57,78 7.57,80 7.32,80.25 | 7.32,77.75 4.57,75 PIN-LDR2.1 | 7.32,80.25 5.82,81.75 4.57,81.75 PIN-LDR3.1 | PIN-LDR4.1 4.57,88 7.57,88 7.57,80.5 7.32,80.25 | v7.57,69.5 7.57,77.5 7.32,77.75 | PIN-S2-COR-2.3 86.57,49.75 84.82,51.5 84.82,54.25 82.07,57 R15.2 81.82,57.25 81.82,64.75 R14.2 81.82,65.25 81.82,73 R8.2 82.07,73.5 82.32,73.75 82.32,84.25 80.32,86.25 R11.2 | R6.2 40.82,90.75 40.82,86.25 PIN-LCD_16X2.5
  Bottom 0.762: CI-M2.8 41.32,24.25 39.32,26.25 21.07,26.25 20.32,25.5 CI-M1.8 | CI-AT3.5 75.82,13 83.32,13 CI-AT3.12 | POWER_SUPPLY_PINS.2 28.82,79.75 26.57,79.75 POWER_SUPPLY_PINS.3 26.32,80 26.32,82 25.82,82 23.32,84.5 23.32,86 PIN-LCD_16X2.12 23.07,86.25 21.32,88 | 7.57,88 4.57,88 PIN-LDR4.1 | 7.57,88 21.32,88 | 7.57,88 7.57,93 6.32,94.25 4.82,94.25 4.57,94.5 PIN-LDR5.1 | v7.57,69.5 7.57,66.5 6.07,65 4.57,65 4.32,64.75 PIN-LDR1.2 | MEGA_PRO_MINI1.GND. 74.82,65 81.82,65 R14.2 | 42.07,89.5 42.32,89.25 49.57,89.25 51.07,87.75 51.07,86.5 PIN-LCD_16X2.1 51.32,86.25 58.57,86.25 R7.2 58.82,86.25 66.07,86.25 R9.2 66.32,86.25 73.07,86.25 R10.2 73.57,86.5 80.07,86.5 R11.2 80.32,86.5 86.57,86.5 R12.2 86.82,86.75 93.57,86.75 R13.2 | 42.07,89.5 R6.2 | 21.32,88 22.57,89.25 41.82,89.25 42.07,89.5 | MEGA_PRO_MINI1.GND... 26.32,37 26.32,35.25 21.82,30.75 11.32,30.75 10.07,29.5 5.82,29.5 4.32,31 4.32,32.5 PIN-LASER4.3
M1-1
  Bottom 0.762: CI-M1.16 12.32,7.5 11.57,6.75 7.32,6.75 6.82,6.25 5.82,6.25 PIN-M1.1
M1-2
  Bottom 0.762: CI-M1.15 12.32,10 12.07,9.75 8.07,9.75 7.32,9 5.82,9 PIN-M1.2
M1-3
  Bottom 0.762: CI-M1.14 12.32,12.5 12.07,12.25 8.07,12.25 7.32,11.5 5.82,11.5 PIN-M1.3
M1-4
  Bottom 0.762: CI-M1.13 12.32,15.25 11.82,14.75 8.07,14.75 7.32,14 5.82,14 PIN-M1.4
M2-1
  Bottom 0.762: CI-M2.16 33.57,6.25 27.32,6.25 PIN-M2.1
M2-2
  Bottom 0.762: CI-M2.15 33.57,9 27.32,9 PIN-M2.2
M2-3
  Bottom 0.762: CI-M2.14 33.57,11.5 27.32,11.5 PIN-M2.3
M2-4
  Bottom 0.762: CI-M2.13 33.57,14 27.32,14 PIN-M2.4
N$3
  Top 0.762: R6.1 47.32,91.75 46.07,90.5 46.07,86.25 PIN-LCD_16X2.3
TRIG  (via drill 0.64)
  Top 0.762: v57.82,42.25 58.57,43 58.57,44.25 71.32,57 76.82,57 76.82,55.25 81.82,50.25 v81.82,34.75
  Bottom 0.762: v57.82,42.25 61.82,42.25 61.82,39.75 MEGA_PRO_MINI1.20 | v81.82,34.75 93.82,34.75 PIN-S1-ULTRASSONICO.2

### Text on the board
Top: IC_V1 Top
Bottom: IC_V1 Button